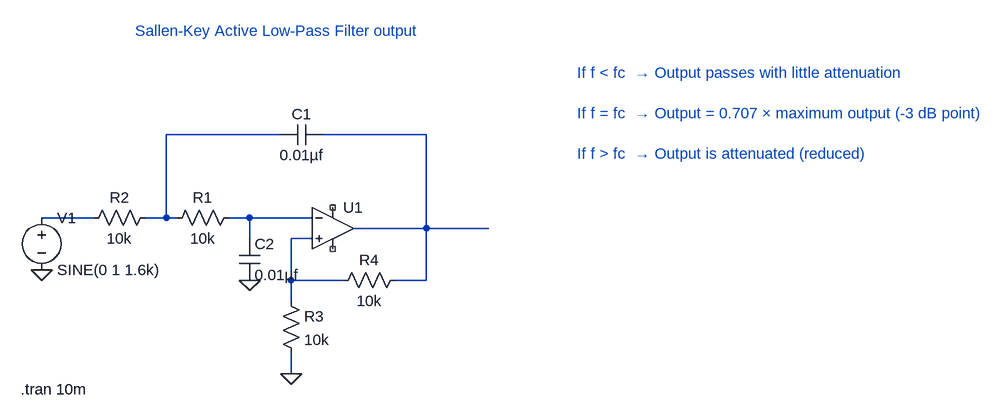
[diagram p0: schematic Sallen-Key Active Low-Pass Filter output.asc]
Sallen-Key Active Low-Pass Filter output.asc, the LTspice schematic file:
Version 4.1
SHEET 1 1016 680
WIRE -144 -16 -320 -16
WIRE 80 -16 -80 -16
WIRE -432 112 -512 112
WIRE -320 112 -320 -16
WIRE -320 112 -352 112
WIRE -304 112 -320 112
WIRE -192 112 -224 112
WIRE -96 112 -192 112
WIRE 80 128 80 -16
WIRE 80 128 -32 128
WIRE 176 128 80 128
WIRE -192 144 -192 112
WIRE -96 144 -128 144
WIRE -128 208 -128 144
WIRE -48 208 -128 208
WIRE 80 208 80 128
WIRE 80 208 32 208
WIRE -128 240 -128 208
WIRE -128 352 -128 320
FLAG -512 192 0
FLAG -128 352 0
FLAG -192 208 0
SYMBOL OpAmps\\UniversalOpAmp1 -64 128 R0
SYMATTR InstName U1
SYMBOL res -208 96 R90
WINDOW 0 0 56 VBottom 2
WINDOW 3 32 56 VTop 2
SYMATTR InstName R1
SYMATTR Value 10k
SYMBOL res -336 96 R90
WINDOW 0 0 56 VBottom 2
WINDOW 3 32 56 VTop 2
SYMATTR InstName R2
SYMATTR Value 10k
SYMBOL res -144 224 R0
SYMATTR InstName R3
SYMATTR Value 10k
SYMBOL res 48 192 R90
WINDOW 0 0 56 VBottom 2
WINDOW 3 32 56 VTop 2
SYMATTR InstName R4
SYMATTR Value 10k
SYMBOL cap -80 -32 R90
WINDOW 0 0 32 VBottom 2
WINDOW 3 32 32 VTop 2
SYMATTR InstName C1
SYMATTR Value 0.01µf
SYMBOL cap -208 144 R0
SYMATTR InstName C2
SYMATTR Value 0.01µf
SYMBOL voltage -512 96 R0
WINDOW 123 0 0 Left 0
WINDOW 39 0 0 Left 0
SYMATTR InstName V1
SYMATTR Value SINE(0 1 1.6k)
TEXT -544 376 Left 2 !.tran 10m
TEXT -368 -176 Left 2 ;Sallen-Key Active Low-Pass Filter output
TEXT 312 -112 Left 2 ;If f < fc  → Output passes with little attenuation\n \nIf f = fc  → Output = 0.707 × maximum output (-3 dB point)\n \nIf f > fc  → Output is attenuated (reduced)

The netlist it stands for:
* Sallen-Key Active Low-Pass Filter output.asc
X§U1 N005 N004 NC_01 NC_02 N002 level1 Avol=1Meg GBW=10Meg Vos=0 En=0 Enk=0 In=0 Ink=0 Rin=500Meg  ; pins In+ In- V+ V- OUT
R1 N004 N001 10k
R2 N001 N003 10k
R3 N005 0 10k
R4 N002 N005 10k
C1 N002 N001 0.01µf
C2 N004 0 0.01µf
V1 N003 0 SINE(0 1 1.6k)
.tran 10m
* Sallen-Key Active Low-Pass Filter output
* If f < fc  → Output passes with little attenuation
* If f = fc  → Output = 0.707 × maximum output (-3 dB point)
* If f > fc  → Output is attenuated (reduced)
.lib UniversalOpAmp1.lib
.backanno
.end